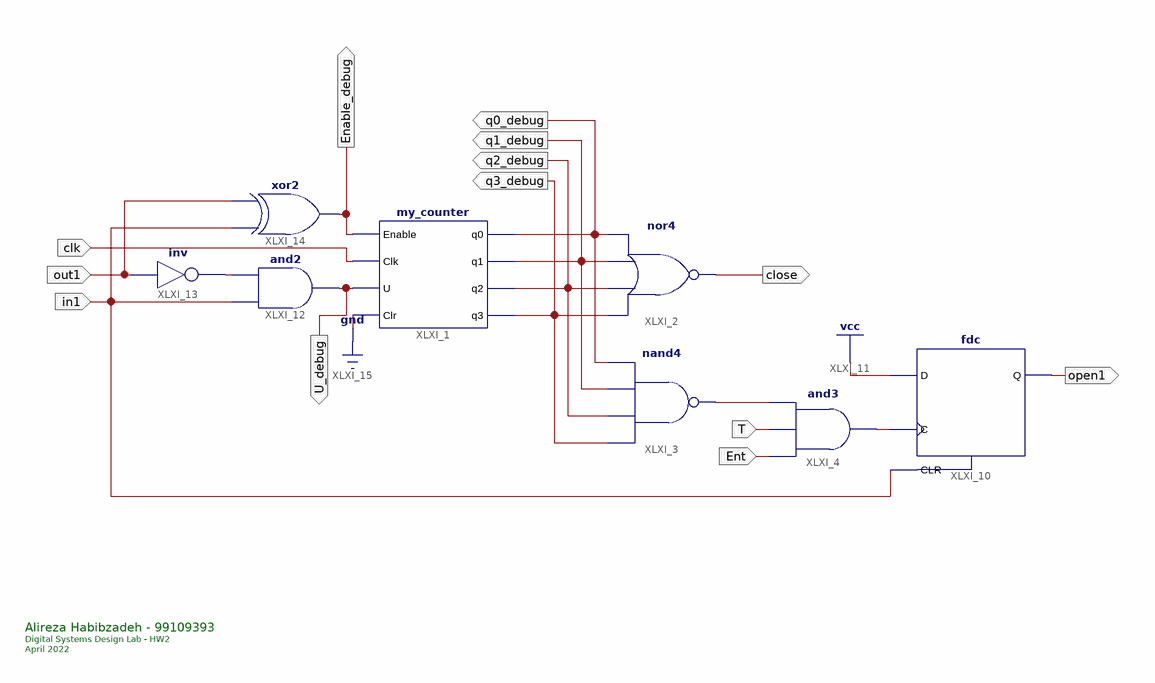
[diagram p0: schematic sheet 1]
// Xilinx ISE schematic room15.sch (artix7) as structural Verilog: 8 symbols, 13 ports
module room15 (
  input  T,
  input  Ent,
  input  clk,
  input  out1,
  input  in1,
  output close,
  output q0_debug,
  output q1_debug,
  output q2_debug,
  output q3_debug,
  output open1,
  output Enable_debug,
  output U_debug
);

  wire XLXN_12, XLXN_15, XLXN_33;

  my_counter XLXI_1 (
    .Enable(Enable_debug), .Clk(clk), .U(U_debug), .Clr(1'b0), .q0(q0_debug), .q1(q1_debug), .q2(q2_debug),
    .q3(q3_debug));
  nor XLXI_2 (close, q3_debug, q2_debug, q1_debug, q0_debug);
  nand XLXI_3 (XLXN_12, q3_debug, q2_debug, q1_debug, q0_debug);
  and XLXI_4 (XLXN_15, Ent, T, XLXN_12);
  fdc XLXI_10 (.C(XLXN_15), .CLR(in1), .D(1'b1), .Q(open1));
  xor XLXI_14 (Enable_debug, in1, out1);
  and XLXI_12 (U_debug, in1, XLXN_33);
  not XLXI_13 (XLXN_33, out1);

  // Notes on the sheet:
  //   Alireza Habibzadeh - 99109393
  //   Digital Systems Design Lab - HW2
  //   April 2022
endmodule
